# EAGLE design low-pass-filter (EAGLE 9.6.2)
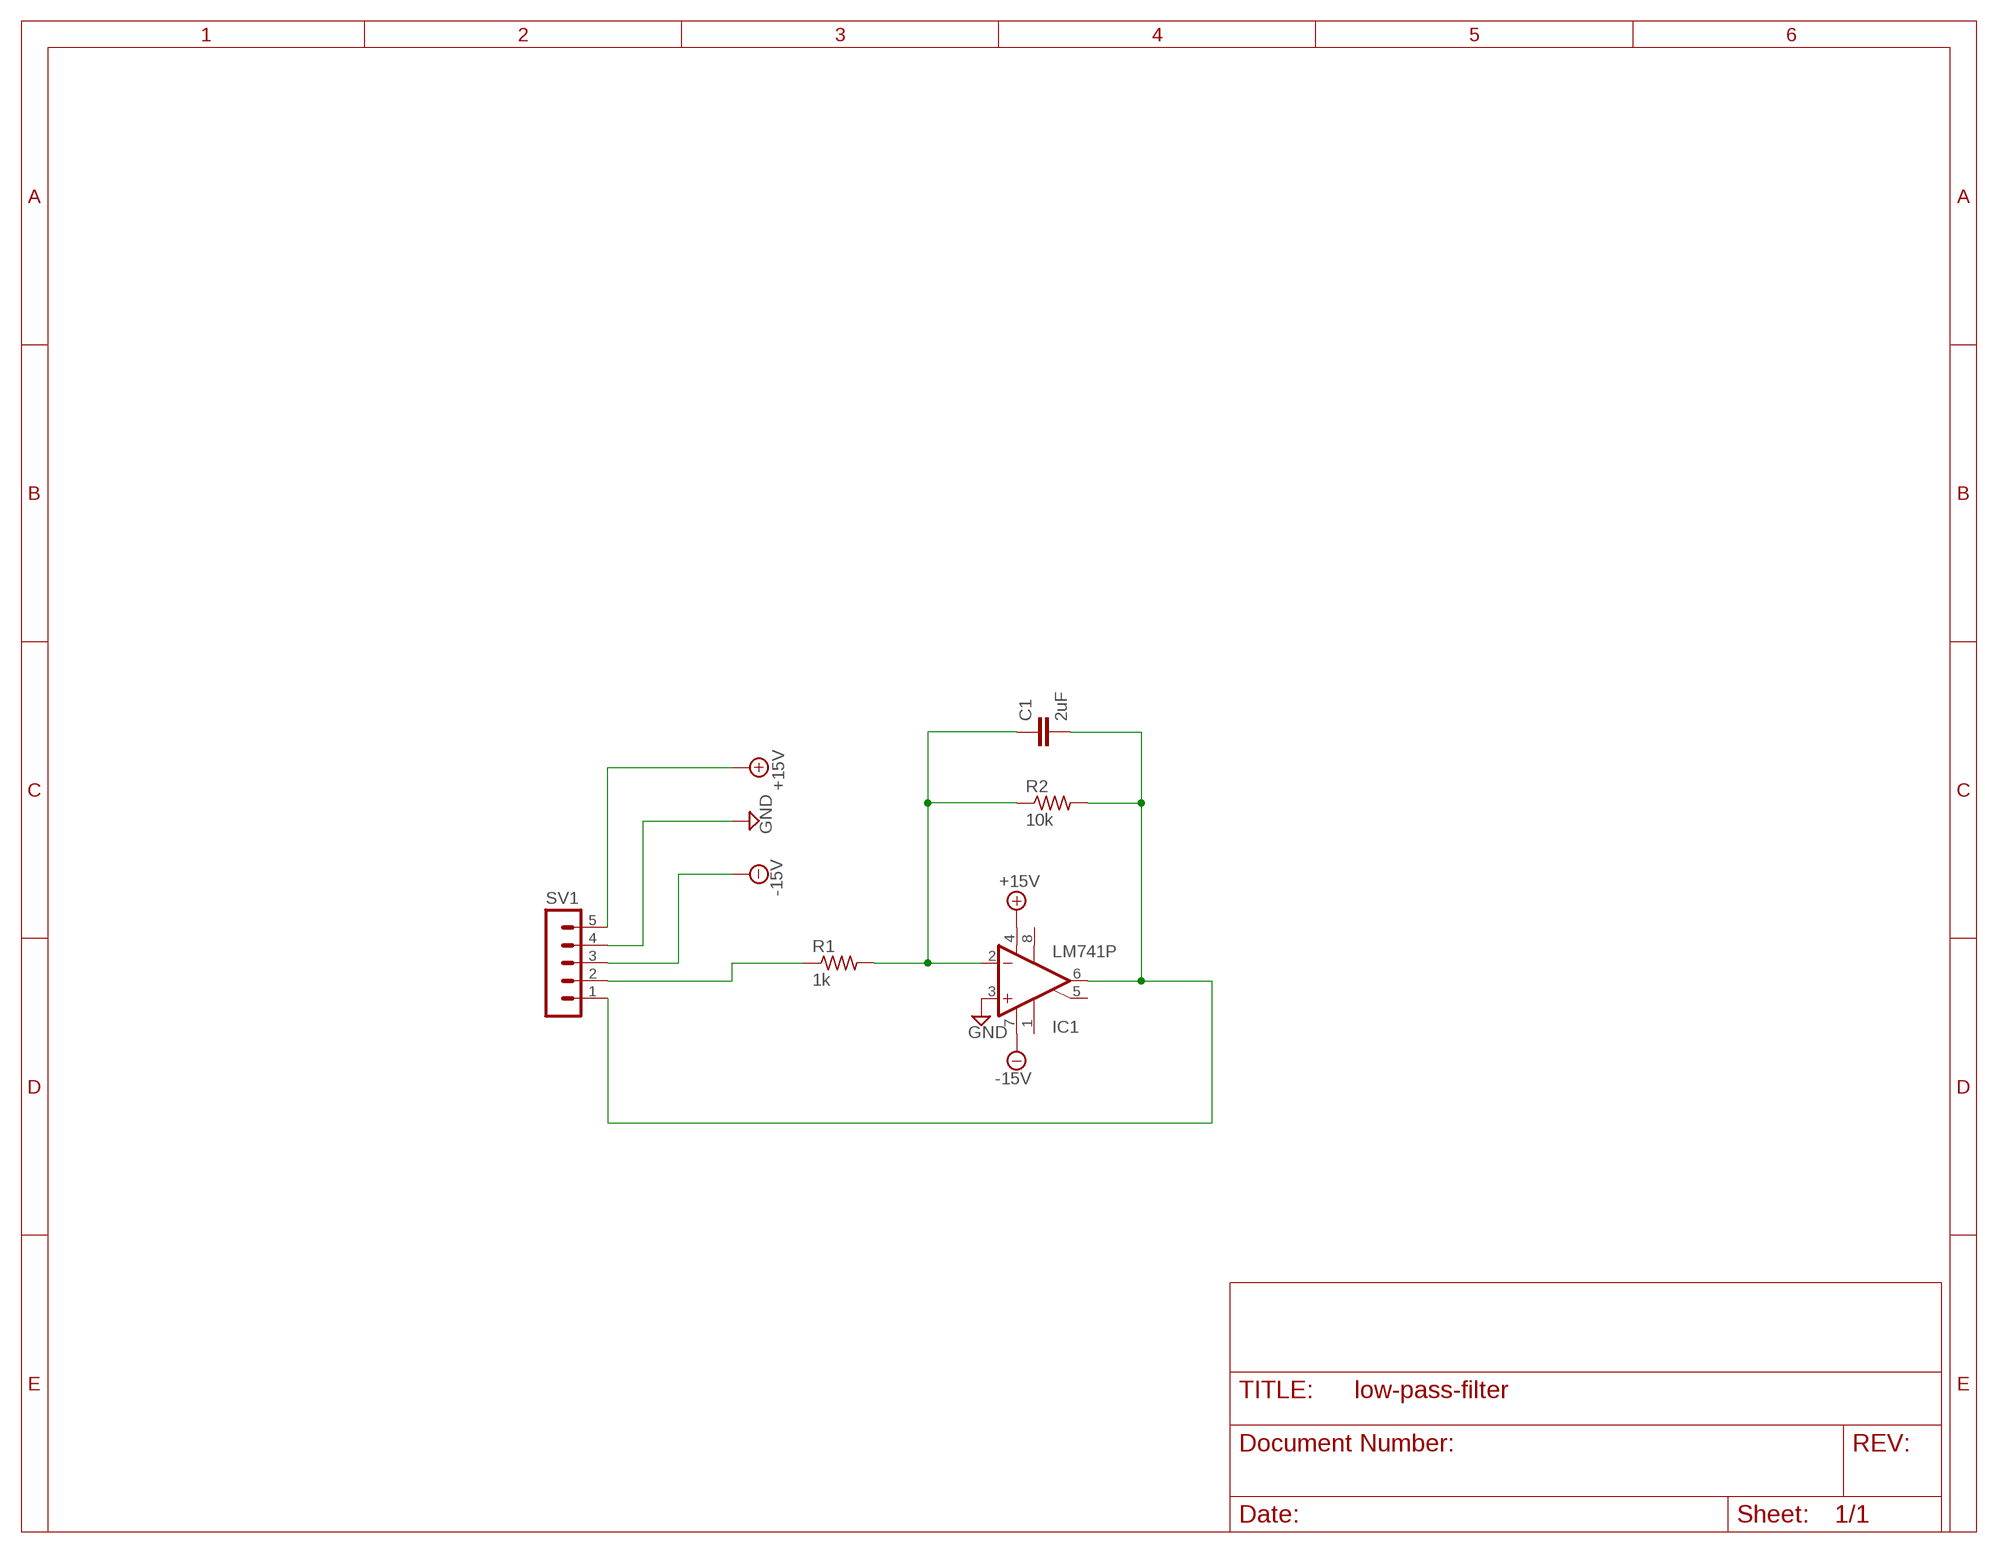
[diagram p0: schematic, sheet 1]

## Parts
C1  2uF  C-EUC0603  [C0603]
IC1  LM741P  [DIL08]
R1  1k  R-US_R0603  [R0603]
R2  10k  R-US_R0603  [R0603]
SV1  MA05-1  [MA05-1]

## Nets
+15V: IC1.4(V-) SV1.5
-15V: IC1.7(V+) SV1.3
GND: IC1.3(+IN) SV1.4
N$1: C1.1 IC1.2(-IN) R1.2 R2.1
N$2: C1.2 IC1.6(OUT) R2.2 SV1.1
N$5: R1.1 SV1.2
Unconnected: IC1.1(ON1) IC1.5(ON2) IC1.8(OPT)

## Library data of the parts
C1 = rcl:C-EU: CAPACITOR, European symbol; SPICEPREFIX: C
IC1 = linear:*741: OP AMP
R1 R2 = rcl:R-US_: RESISTOR, American symbol; SPICEPREFIX: R
SV1 = con-lstb:MA05-1: PIN HEADER; OC_FARNELL: unknown; OC_NEWARK: unknown

## Board
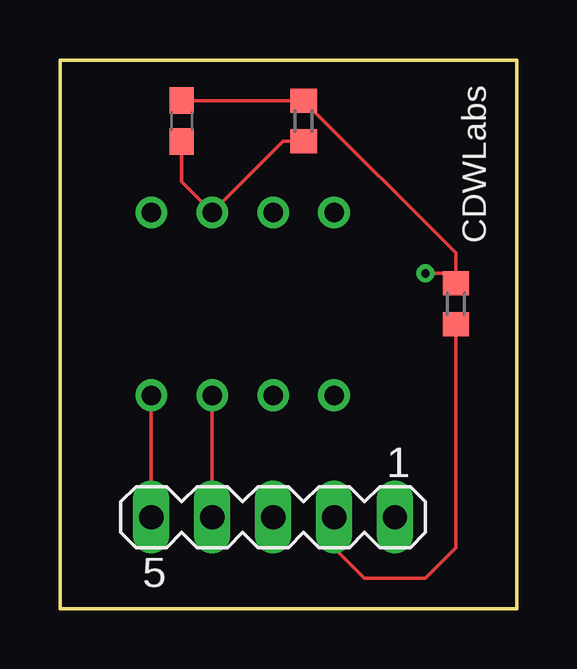
[diagram p1: board, top side]
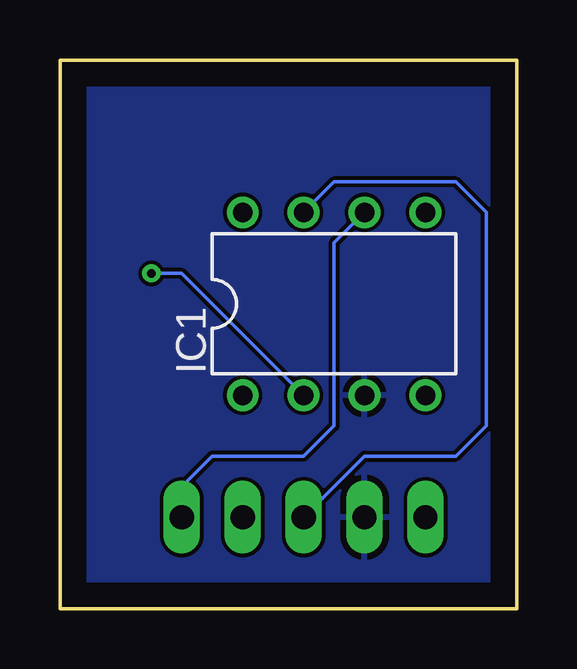
[diagram p2: board, bottom side, seen from below]

Size 19.05 x 22.86 mm. Coordinates in mm from the lower left corner, seen from the top.
Outline: 0,0 0,22.86 19.05,22.86 19.05,0 0,0
Copper layers (1*16): Top 0.035mm / dielectric 1.5mm / Bottom 0.035mm
Design rules "default": minimum track width 6mil, minimum drill 0.35mm, track to track 6mil, track to pad 6mil, pad to pad 6mil, via to via 6mil, smd to smd 6mil, copper to edge 40mil, drill to drill 6mil, minimum pad ring 10mil, minimum via ring 8mil, stop-mask expansion 4mil, vias tented up to drill 0mil, thermal gap 10mil

### Footprints (pad centres in the part's own frame; a part is rotated, then mirrored left to right if it is on the bottom)
C0603 = smd 1.1 x 1: 1 -0.85,0; 2 0.85,0
DIL08 = drill 0.813 pad 1.27: 1 -3.81,-3.81; 2 -1.27,-3.81; 3 1.27,-3.81; 4 3.81,-3.81; 5 3.81,3.81; 6 1.27,3.81; 7 -1.27,3.81; 8 -3.81,3.81
R0603 = smd 1 x 1.1: 1 -0.85,0; 2 0.85,0
MA05-1 = drill 1.016 long: 1 -5.08,0; 2 -2.54,0; 3 0,0; 4 2.54,0; 5 5.08,0

### Placement (x,y rotation side)
C1  5.08,20.32 270 top
IC1  7.62,12.7 0 bottom
R1  16.51,12.7 90 top
R2  10.16,20.32 270 top
SV1  8.89,3.81 180 top

### Tracks (layer width: path | path; a pad name or v marks a point on that pad's centre or on a via)
+15V
  Top 0.152: SV1.5 IC1.4
-15V
  Bottom 0.152: SV1.3 6.35,6.35 2.54,6.35 1.27,7.62 1.27,16.51 2.54,17.78 7.62,17.78 IC1.7
GND
  Top 0.152: SV1.4 IC1.3
  pour Bottom: 0,22.86 19.05,22.86 19.05,0 0,0
N$1  (via drill 0.35)
  Top 0.152: C1.1 R2.1 16.51,14.82 R1.2 16.09,13.97 v15.24,13.97
  Bottom 0.152: IC1.2 13.97,13.97 v15.24,13.97
N$2
  Top 0.152: C1.2 5.08,17.78 IC1.6 9.31,19.47 R2.2
  Bottom 0.152: IC1.6 7.62,15.24 7.62,7.62 8.89,6.35 12.7,6.35 13.97,5.08 SV1.1
N$5
  Top 0.152: SV1.2 11.43,2.54 12.7,1.27 15.24,1.27 16.51,2.54 R1.1

### Text on the board
tPlace: CDWLabs